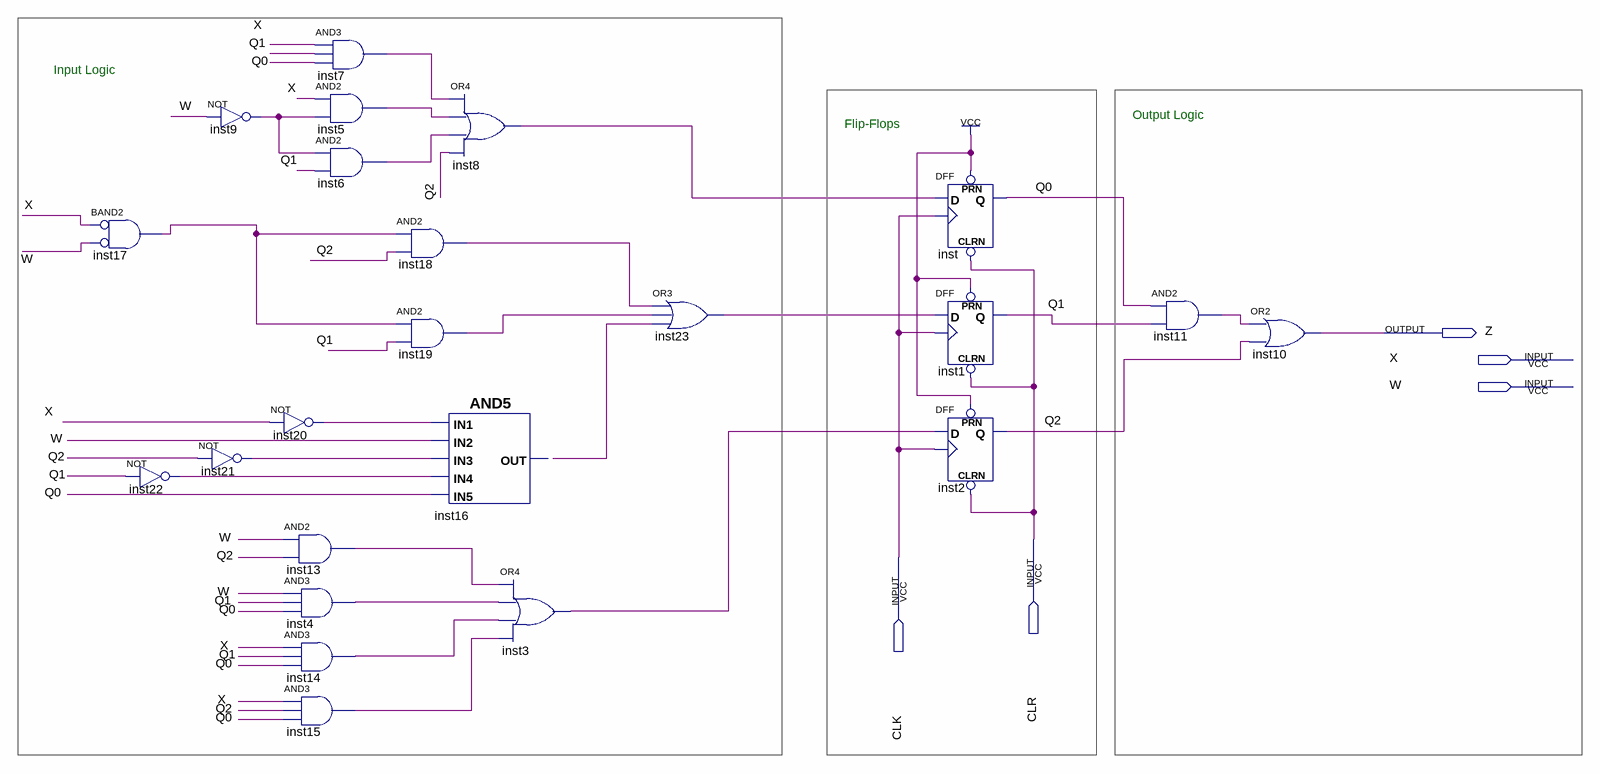
[diagram p0: schematic sheet]
// Quartus schematic Esquema_FF.bdf as structural Verilog: 23 symbols, 5 pins
module Esquema_FF (
  input  X,
  input  W,
  input  CLR,
  input  CLK,
  output Z
);

  wire inst3_out, inst4_out, inst5_out, inst6_out, inst7_out, inst8_out, inst9_out, inst11_out, inst13_out,
       inst14_out, inst15_out, inst17_out, inst18_out, inst19_out, inst20_out, inst21_out, inst22_out,
       inst23_out, Q0, Q1, Q2, undriven;

  and inst17 (inst17_out, ~X, ~W);  // BAND2
  not inst22 (inst22_out, Q1);
  not inst9 (inst9_out, W);
  not inst21 (inst21_out, Q2);
  not inst20 (inst20_out, X);
  and inst13 (inst13_out, W, Q2);
  and inst4 (inst4_out, W, Q1, Q0);
  and inst14 (inst14_out, X, Q1, Q0);
  and inst15 (inst15_out, X, Q2, Q0);
  and inst7 (inst7_out, X, Q1, Q0);
  and inst5 (inst5_out, X, inst9_out);
  and inst6 (inst6_out, inst9_out, Q1);
  and inst18 (inst18_out, inst17_out, Q2);
  and inst19 (inst19_out, inst17_out, Q1);
  // AND5 inst16 has open pins: IN1=inst20_out, IN2=W, IN3=inst21_out, IN4=inst22_out, IN5=Q0, OUT=open
  or inst8 (inst8_out, inst7_out, inst5_out, inst6_out, Q2);
  or inst3 (inst3_out, inst13_out, inst4_out, inst14_out, inst15_out);
  or inst23 (inst23_out, inst18_out, inst19_out, undriven);
  DFF inst (.CLRN(CLR), .CLK(CLK), .D(inst8_out), .PRN(1'b1), .Q(Q0));
  DFF inst1 (.CLRN(CLR), .CLK(CLK), .D(inst23_out), .PRN(1'b1), .Q(Q1));
  DFF inst2 (.CLRN(CLR), .CLK(CLK), .D(inst3_out), .PRN(1'b1), .Q(Q2));
  and inst11 (inst11_out, Q0, Q1);
  or inst10 (Z, inst11_out, Q2);

  // Notes on the sheet:
  //   Input Logic
  //   Output Logic
  //   Flip-Flops
endmodule
